# Altium schematic sheet main.SchDoc
size A4
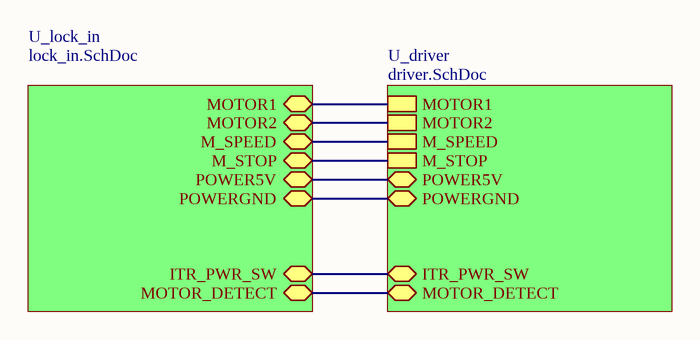
[diagram p0: main.SchDoc]

## Sub-sheets
U_driver = driver.SchDoc: MOTOR1, MOTOR2, M_SPEED, M_STOP, POWER5V, POWERGND, ITR_PWR_SW, MOTOR_DETECT
U_lock_in = lock_in.SchDoc: MOTOR1, MOTOR2, M_SPEED, M_STOP, POWERGND, POWER5V, ITR_PWR_SW, MOTOR_DETECT

## Nets
(unnamed): sheet U_driver/MOTOR1, sheet U_lock_in/MOTOR1
(unnamed): sheet U_driver/MOTOR2, sheet U_lock_in/MOTOR2
(unnamed): sheet U_driver/M_SPEED, sheet U_lock_in/M_SPEED
(unnamed): sheet U_driver/M_STOP, sheet U_lock_in/M_STOP
(unnamed): sheet U_driver/POWER5V, sheet U_lock_in/POWER5V
(unnamed): sheet U_driver/POWERGND, sheet U_lock_in/POWERGND
(unnamed): sheet U_driver/ITR_PWR_SW, sheet U_lock_in/ITR_PWR_SW
(unnamed): sheet U_driver/MOTOR_DETECT, sheet U_lock_in/MOTOR_DETECT